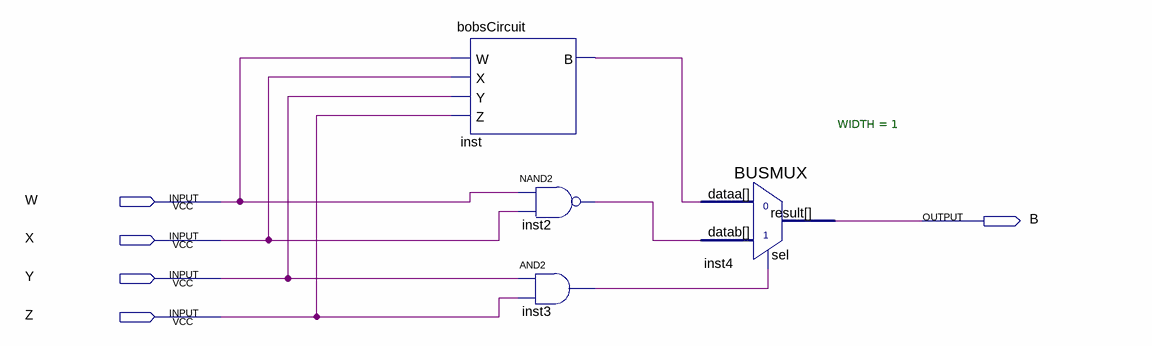
[diagram p0: schematic sheet]
// Quartus schematic primeNumbers.bdf as structural Verilog: 4 symbols, 5 pins
module primeNumbers (
  input  W,
  input  X,
  input  Y,
  input  Z,
  output B
);

  wire inst2_out, inst3_out, inst_b;

  bobsCircuit inst (.W(W), .X(X), .Y(Y), .Z(Z), .B(inst_b));
  nand inst2 (inst2_out, W, X);
  and inst3 (inst3_out, Y, Z);
  BUSMUX #(.WIDTH(1)) inst4 (.datab(inst2_out), .sel(inst3_out), .dataa(inst_b), .result(B));
endmodule
